# EAGLE schematic badge (EAGLE 6.2)
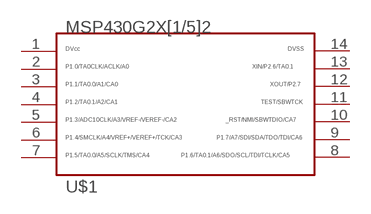
[diagram p0: schematic, sheet 1]

## Parts
U$1  G2X[1/5]2---PW14  [PW14]
Unconnected: U$1.1 U$1.2 U$1.3 U$1.4 U$1.5 U$1.6 U$1.7 U$1.8 U$1.9 U$1.10 U$1.11 U$1.12 U$1.13 U$1.14

## Library data of the parts
U$1 = TI_MSP430_v16:G2X[1/5]2---PW14: MSP430G2X[1/5]2 MSP430G2x52, MSP430G2x12 TSSOP (PW) 14 Pin Package http://focus.ti.com/docs/prod/folders/print/msp430g2452.html